# Altium project PCBReceiverProject.PrjPCB
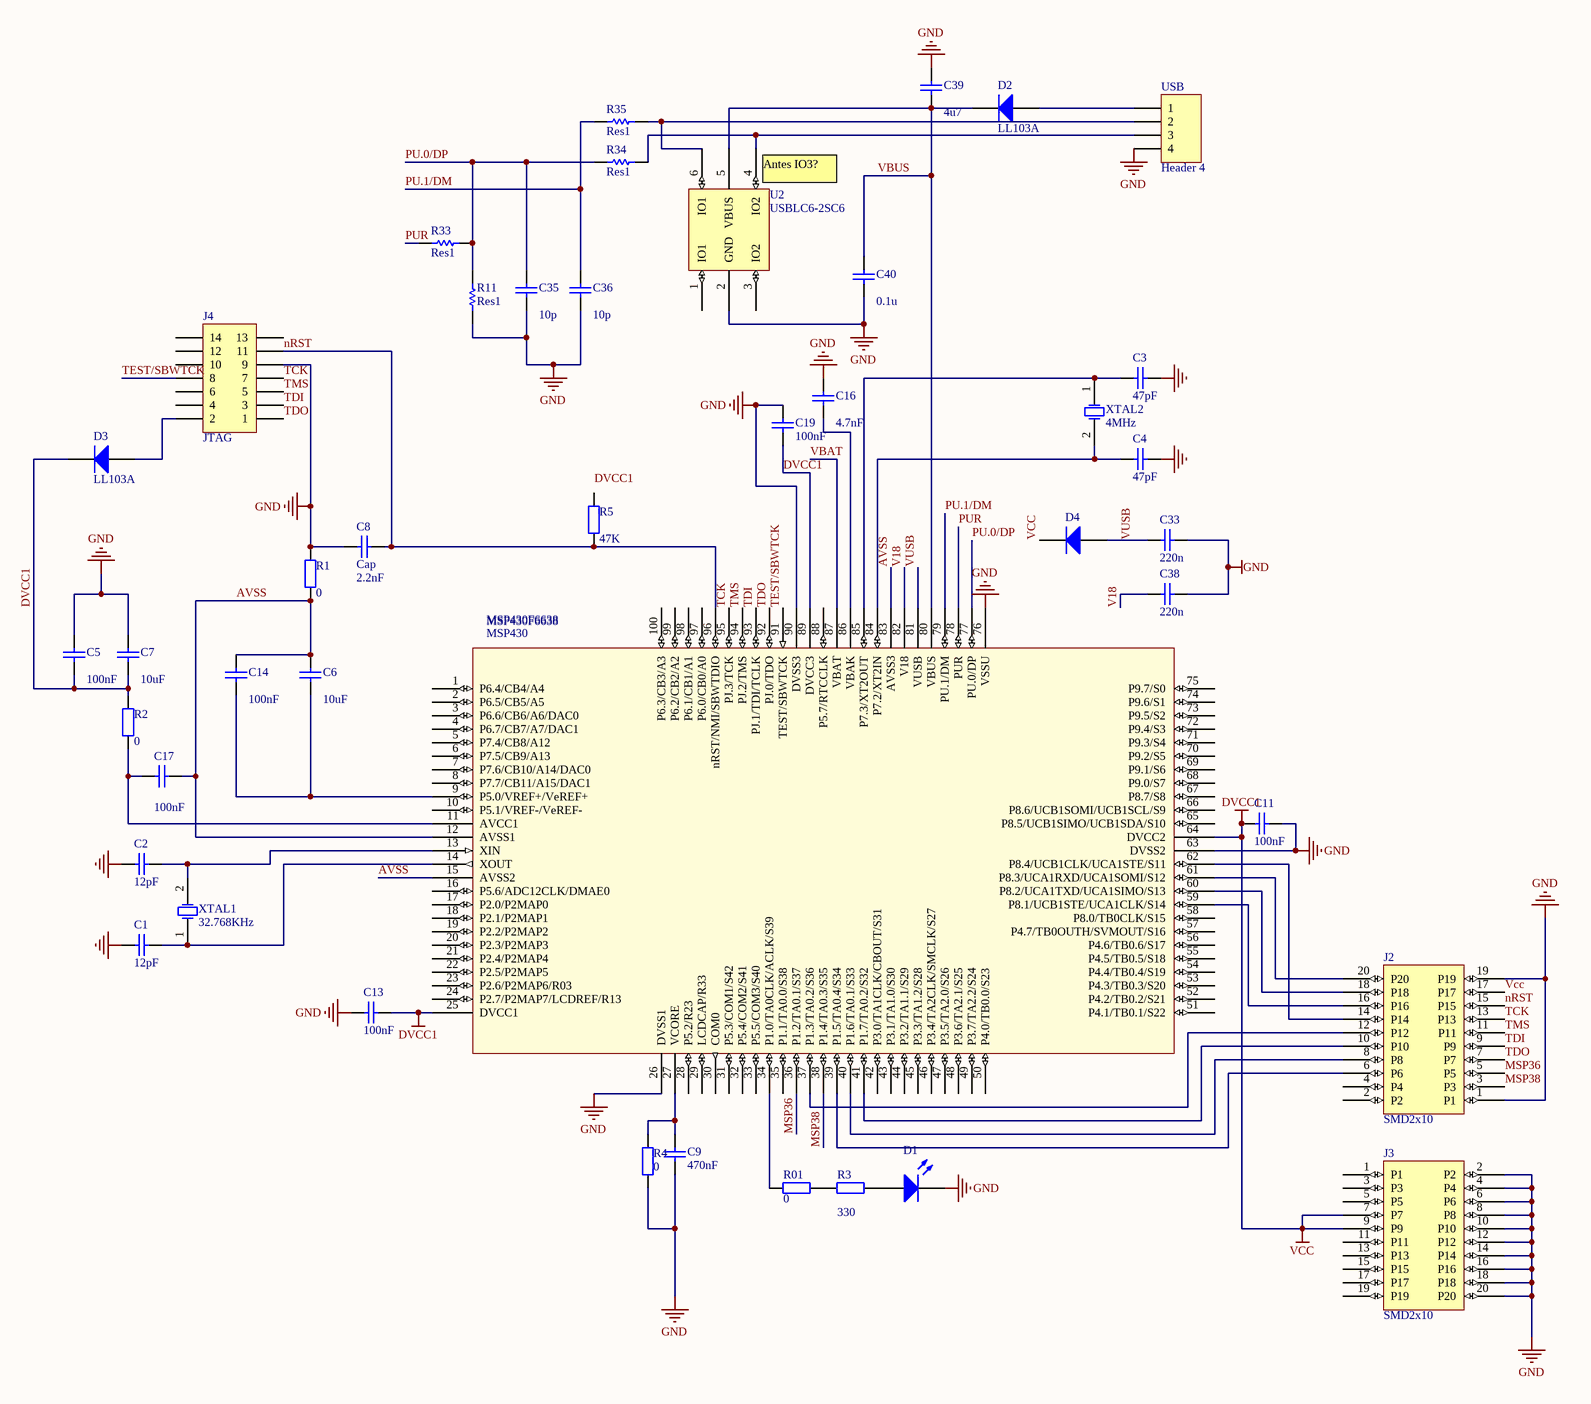
[diagram p0: Receiver.SchDoc]
1 sheet, 43 parts. Net scope: global (net labels, ports and power ports of the same name join across sheets).
Board file: Receiver.PcbDoc

## Sheet Receiver.SchDoc
size A2

### Parts
C1  12pF  [CC2012-0805]
C2  12pF  [CC2012-0805]
C3  47pF  [CC2012-0805]
C4  47pF  [CC2012-0805]
C5  100nF  [CC2012-0805]
C6  10uF  [3.5x2.8x1.9]
C7  10uF  [3.5x2.8x1.9]
C8  Cap  value 2.2nF  [CC2012-0805]
C9  470nF  [CC2012-0805]
C11  100nF  [CC2012-0805]
C13  100nF  [CC2012-0805]
C14  100nF  [CC2012-0805]
C16  4.7nF  [0603]
C17  100nF  [CC2012-0805]
C19  100nF  [CC2012-0805]
C33  220n  [0603]
C35  10p  [0603]
C36  10p  [0603]
C38  220n  [0603]
C39  4u7  [0603]
C40  0.1u  [0603]
D1  LED2  [CC2012-0805]  (value not drawn)
D2  LL103A  [MELF-D3516-1406]
D3  LL103A  [CC2012-0805]
D4  LL103A  [CC2012-0805]  (value not drawn)
J2  SMD2x10  [MHDR2X10]
J3  SMD2x10  [MHDR2X10]
J4  JTAG  [HDR2X7]
MSP430  MSP430F6638  [PZ100_L]
R01  value 0  [CC2012-0805]  (hidden comment: Res2)
R1  0  [CC2012-0805]
R2  0  [CC2012-0805]
R3  330  [CC2012-0805]
R4  0  [cc2012-0805]
R5  value 47K  [CC2012-0805]  (hidden comment: Res2)
R11  Res1  [0603]
R33  Res1  [0603]
R34  Res1  [0603]
R35  Res1  [0603]
U2  USBLC6-2SC6  [SOT23-6_L]
USB  Header 4  [HDR1X4]
XTAL1  Part: 32.768KHz  [XTAL MS1V-T1K bis]  (hidden comment: Q1)
XTAL2  Part: 4MHz  [HC49/4H]  (hidden comment: Q2)

### Nets
DVCC1: C5.1 C7.1 C11.1 C13.2 C19.1 D3.2(K) D4.2(K) J2.17(P17) J3.7(P7) J3.9(P9) MSP430.25(DVCC1) MSP430.64(DVCC2) MSP430.89(DVCC3) R2.2  [also labelled VCC]
GND: C1.2 C2.2 C3.2 C4.2 C5.2 C7.2 C8.2 C9.1 C11.2 C13.1 C16.2 C19.2 C33.2 C35.1 C36.1 C38.2 C39.1 C40.2 D1.2(K) J2.1(P1) J2.19(P19) J3.2(P2) J3.4(P4) J3.6(P6) J3.8(P8) J3.10(P10) J3.12(P12) J3.14(P14) J3.16(P16) J3.18(P18) J3.20(P20) J4.9 MSP430.26(DVSS1) MSP430.63(DVSS2) MSP430.76(VSSU) MSP430.90(DVSS3) R1.2 R4.1 R11.1 U2.2(GND) USB.4
AVSS: C6.2 C14.2 C17.1 MSP430.12(AVSS1) MSP430.15(AVSS2) MSP430.83(AVSS3) R1.1
MSP36: J2.5(P5) MSP430.36(P1.2/TA0.1/S37)
MSP38: J2.3(P3) MSP430.38(P1.4/TA0.3/S35)
nRST: C8.1 J2.15(P15) J4.11 MSP430.96(nRST/NMI/SBWTDIO) R5.1
PU.0/DP: C35.2 MSP430.77(PU.0/DP) R11.2 R33.2 R34.1
PU.1/DM: C36.2 MSP430.79(PU.1/DM) R35.1
PUR: MSP430.78(PUR) R33.1
TCK: J2.13(P13) J4.7 MSP430.95(PJ.3/TCK)
TDI: J2.9(P9) J4.3 MSP430.93(PJ.1/TDI/TCLK)
TDO: J2.7(P7) J4.1 MSP430.92(PJ.0/TDO)
TEST/SBWTCK: J4.8 MSP430.91(TEST/SBWTCK)
TMS: J2.11(P11) J4.5 MSP430.94(PJ.2/TMS)
V18: C38.1 MSP430.82(V18)
VBAT: MSP430.87(VBAT)
VBUS: C39.2 C40.1 D2.2(K) MSP430.80(VBUS) U2.5(VBUS)
VUSB: C33.1 D4.1(A) MSP430.81(VUSB)
NetC1_1: C1.1 MSP430.14(XOUT) XTAL1.1(OSC1)
NetC2_1: C2.1 MSP430.13(XIN) XTAL1.2(OSC2)
NetC3_1: C3.1 MSP430.85(P7.3/XT2OUT) XTAL2.1(OSC1)
NetC4_1: C4.1 MSP430.84(P7.2/XT2IN) XTAL2.2(OSC2)
NetC6_1: C6.1 C14.1 MSP430.9(P5.0/VREF+/VeREF+)
NetC9_2: C9.2 MSP430.27(VCORE) R4.2
NetC16_1: C16.1 MSP430.86(VBAK)
NetC17_2: C17.2 MSP430.11(AVCC1) R2.1
NetD1_1: D1.1(A) R3.2
NetD2_1: D2.1(A) USB.1
NetD3_1: D3.1(A) J4.2
NetJ2_6: J2.6(P6) MSP430.39(P1.5/TA0.4/S34)
NetJ2_8: J2.8(P8) MSP430.40(P1.6/TA0.1/S33)
NetJ2_10: J2.10(P10) MSP430.41(P1.7/TA0.2/S32)
NetJ2_12: J2.12(P12) MSP430.37(P1.3/TA0.2/S36)
NetJ2_14: J2.14(P14) MSP430.62(P8.4/UCB1CLK/UCA1STE/S11)
NetJ2_16: J2.16(P16) MSP430.59(P8.1/UCB1STE/UCA1CLK/S14)
NetJ2_18: J2.18(P18) MSP430.60(P8.2/UCA1TXD/UCA1SIMO/S13)
NetJ2_20: J2.20(P20) MSP430.61(P8.3/UCA1RXD/UCA1SOMI/S12)
NetMSP430_34: MSP430.34(P1.0/TA0CLK/ACLK/S39) R01.1
NetR01_2: R01.2 R3.1
NetR34_2: R34.2 U2.4(IO2) USB.3
NetR35_2: R35.2 U2.6(IO1) USB.2

Not connected (* = marked no-connect by the designer): J2 2(P2) 4(P4); J3 1(P1) 3(P3) 5(P5) 11(P11) 13(P13) 15(P15) 17(P17) 19(P19); J4 4 6 10 12 13 14; MSP430 1(P6.4/CB4/A4) 2(P6.5/CB5/A5) 3(P6.6/CB6/A6/DAC0) 4(P6.7/CB7/A7/DAC1) 5(P7.4/CB8/A12) 6(P7.5/CB9/A13) 7(P7.6/CB10/A14/DAC0) 8(P7.7/CB11/A15/DAC1) 10(P5.1/VREF-/VeREF-) 16(P5.6/ADC12CLK/DMAE0) 17(P2.0/P2MAP0) 18(P2.1/P2MAP1) 19(P2.2/P2MAP2) 20(P2.3/P2MAP3) 21(P2.4/P2MAP4) 22(P2.5/P2MAP5) 23(P2.6/P2MAP6/R03) 24(P2.7/P2MAP7/LCDREF/R13) 28(P5.2/R23) 29(LCDCAP/R33) 30(COM0) 31(P5.3/COM1/S42) 32(P5.4/COM2/S41) 33(P5.5/COM3/S40) 35(P1.1/TA0.0/S38) 42(P3.0/TA1CLK/CBOUT/S31) 43(P3.1/TA1.0/S30) 44(P3.2/TA1.1/S29) 45(P3.3/TA1.2/S28) 46(P3.4/TA2CLK/SMCLK/S27) 47(P3.5/TA2.0/S26) 48(P3.6/TA2.1/S25) 49(P3.7/TA2.2/S24) 50(P4.0/TB0.0/S23) 51(P4.1/TB0.1/S22) 52(P4.2/TB0.2/S21) 53(P4.3/TB0.3/S20) 54(P4.4/TB0.4/S19) 55(P4.5/TB0.5/S18) 56(P4.6/TB0.6/S17) 57(P4.7/TB0OUTH/SVMOUT/S16) 58(P8.0/TB0CLK/S15) 65(P8.5/UCB1SIMO/UCB1SDA/S10) 66(P8.6/UCB1SOMI/UCB1SCL/S9) 67(P8.7/S8) 68(P9.0/S7) 69(P9.1/S6) 70(P9.2/S5) 71(P9.3/S4) 72(P9.4/S3) 73(P9.5/S2) 74(P9.6/S1) 75(P9.7/S0) 88(P5.7/RTCCLK) 97(P6.0/CB0/A0) 98(P6.1/CB1/A1) 99(P6.2/CB2/A2) 100(P6.3/CB3/A3); R5 2; U2 1(IO1) 3(IO2)

### Notes on the sheet
- (near U2) Antes IO3?
- Labels drawn without touching a wire or pin: DVCC1

### Library data of the parts
C1 C3 = Cap: Capacitor; pin to pad: 1>2 2>1; Part Description: CAP,  NP0; Voltage: 50V; Reference: C21; Tolerance: 5%; Revision: July-2002: Re-released for DXP Platform.; Case: 0603
  C1: Value: 12pF
  C3: Value: 47pF
C2 C4 = Cap: Capacitor; pin to pad: 1>2 2>1; Part Description: CAP,  NP0; Voltage: 50V; Reference: C20; Tolerance: 5%; Revision: July-2002: Re-released for DXP Platform.; Case: 0603
  C2: Value: 12pF
  C4: Value: 47pF
C5 C8 C9 C11 C13 C14 C16 C17 C19 C33 C35 C36 C38-C40 = Cap: Capacitor; Published: 8-Jun-2000; LatestRevisionDate: 17-Jul-2002; LatestRevisionNote: Re-released for DXP Platform.; PackageReference: RAD-0.3; Publisher: Altium Limited; PackageDescription: Radial Cap, Thru-Hole; 2 Leads; 0.3 in Pin Spacing
  C5 C11 C13 C14 C17 C19: Value: 100nF
  C9: Value: 470nF
  C16: Value: 4.7nF
  C33 C38: Value: 220n
  C35 C36: Value: 10p
  C39: Value: 4u7
  C40: Value: 0.1u
C6 C7 = Cap: Capacitor; Voltage: 6.3V; Published: 8-Jun-2000; LatestRevisionDate: 17-Jul-2002; LatestRevisionNote: Re-released for DXP Platform.; PackageReference: RAD-0.3; Publisher: Altium Limited; PackageDescription: Radial Cap, Thru-Hole; 2 Leads; 0.3 in Pin Spacing; Value: 10uF
D1 = LED2: GREEN LED; Published: 8-Jun-2000; LatestRevisionDate: 17-Jul-2002; LatestRevisionNote: Re-released for DXP Platform.; PackageVersion: Feb-2002; PackageReference: 3.2X1.6X1.1; Publisher: Altium Limited; PackageDescription: SM LED; 2 Flat Leads
D2 D3 = Diode: Default Diode; Published: 8-Jun-2000; LatestRevisionDate: 17-Jul-2002; LatestRevisionNote: Re-released for DXP Platform.; PackageVersion: Sep-1996; PackageReference: SMC; Publisher: Altium Limited; PackageDescription: DO-214-AB/SMC; 2 C-Bend Leads; Body 7.9 x 5.9 mm, inc. leads (LxW); Code_JEDEC: DO-214-AB
D4 = Diode: Published: 8-Jun-2000; LatestRevisionDate: 17-Jul-2002; LatestRevisionNote: Re-released for DXP Platform.; PackageVersion: Sep-1996; PackageReference: SMC; Publisher: Altium Limited; PackageDescription: DO-214-AB/SMC; 2 C-Bend Leads; Body 7.9 x 5.9 mm, inc. leads (LxW); Code_JEDEC: DO-214-AB
J4 = Header 7X2: Header, 7-Pin, Dual row; LatestRevisionDate: 17-Jul-2002; LatestRevisionNote: Re-released for DXP Platform.; Publisher: Altium Limited
R1 R2 = Res2: 0R; Published: 8-Jun-2000; LatestRevisionDate: 17-Jul-2002; LatestRevisionNote: Re-released for DXP Platform.; PackageReference: AXIAL-0.4; Publisher: Altium Limited; PackageDescription: Axial Device, Thru-Hole; 2 Leads; 0.4 in Pin Spacing; Value: 0
R3 = Res2: Resistor; Published: 8-Jun-2000; LatestRevisionDate: 17-Jul-2002; LatestRevisionNote: Re-released for DXP Platform.; PackageReference: AXIAL-0.4; Publisher: Altium Limited; PackageDescription: Axial Device, Thru-Hole; 2 Leads; 0.4 in Pin Spacing; Value: 330
R4 = Res2: Published: 8-Jun-2000; LatestRevisionDate: 17-Jul-2002; LatestRevisionNote: Re-released for DXP Platform.; PackageReference: AXIAL-0.4; Publisher: Altium Limited; PackageDescription: Axial Device, Thru-Hole; 2 Leads; 0.4 in Pin Spacing; Value: 0
R5 = Res2: 47K; Published: 8-Jun-2000; LatestRevisionDate: 17-Jul-2002; LatestRevisionNote: Re-released for DXP Platform.; PackageReference: AXIAL-0.4; Publisher: Altium Limited; PackageDescription: Axial Device, Thru-Hole; 2 Leads; 0.4 in Pin Spacing
R11 = Res1: Resistor; Value: 1M; Published: 8-Jun-2000; LatestRevisionDate: 17-Jul-2002; LatestRevisionNote: Re-released for DXP Platform.; PackageReference: AXIAL-0.3; Publisher: Altium Limited; PackageDescription: Axial Device, Thru-Hole; 2 Leads; 0.3 in Pin Spacing
R33 = Res1: Resistor; Value: 1K4; Published: 8-Jun-2000; LatestRevisionDate: 17-Jul-2002; LatestRevisionNote: Re-released for DXP Platform.; PackageReference: AXIAL-0.3; Publisher: Altium Limited; PackageDescription: Axial Device, Thru-Hole; 2 Leads; 0.3 in Pin Spacing
R34 R35 = Res1: Resistor; Value: 27; Published: 8-Jun-2000; LatestRevisionDate: 17-Jul-2002; LatestRevisionNote: Re-released for DXP Platform.; PackageReference: AXIAL-0.3; Publisher: Altium Limited; PackageDescription: Axial Device, Thru-Hole; 2 Leads; 0.3 in Pin Spacing
USB = Header 4: Header, 4-Pin; LatestRevisionDate: 17-Jul-2002; LatestRevisionNote: Re-released for DXP Platform.; Publisher: Altium Limited
XTAL1 = XTAL MS1V-T1K: Manufacturer/Code: CITIZEN AMERICA / CFS206-32.768-KDZF-UB; Part Description: CRYSTAL, 32.768KHZ, 20ppm, CL=12pF; Value: 32.768000KHz; Distributor/Code: FARNELL / 1457084; Case: 2 x 6mm CYLINDER THT
XTAL2 = XTAL MS1V-T1K: Manufacturer/Code: CITIZEN AMERICA / CFS206-32.768-KDZF-UB; Part Description: CRYSTAL, 4MHz, ?ppm, CL=?pF; Value: 4MHz; Distributor/Code: FARNELL / 1457084; Case: 2 x 6mm CYLINDER THT
R01 = Res2: Published: 8-Jun-2000; LatestRevisionDate: 17-Jul-2002; LatestRevisionNote: Re-released for DXP Platform.; PackageReference: AXIAL-0.4; Publisher: Altium Limited; PackageDescription: Axial Device, Thru-Hole; 2 Leads; 0.4 in Pin Spacing